# Altium schematic sheet ethernet.SchDoc: Edison Gateway - Ethernet
size Letter; Author: Ye-Sheng Kuo; DocumentNumber: 6; Revision: 3; SheetNumber: 6; SheetTotal: 10
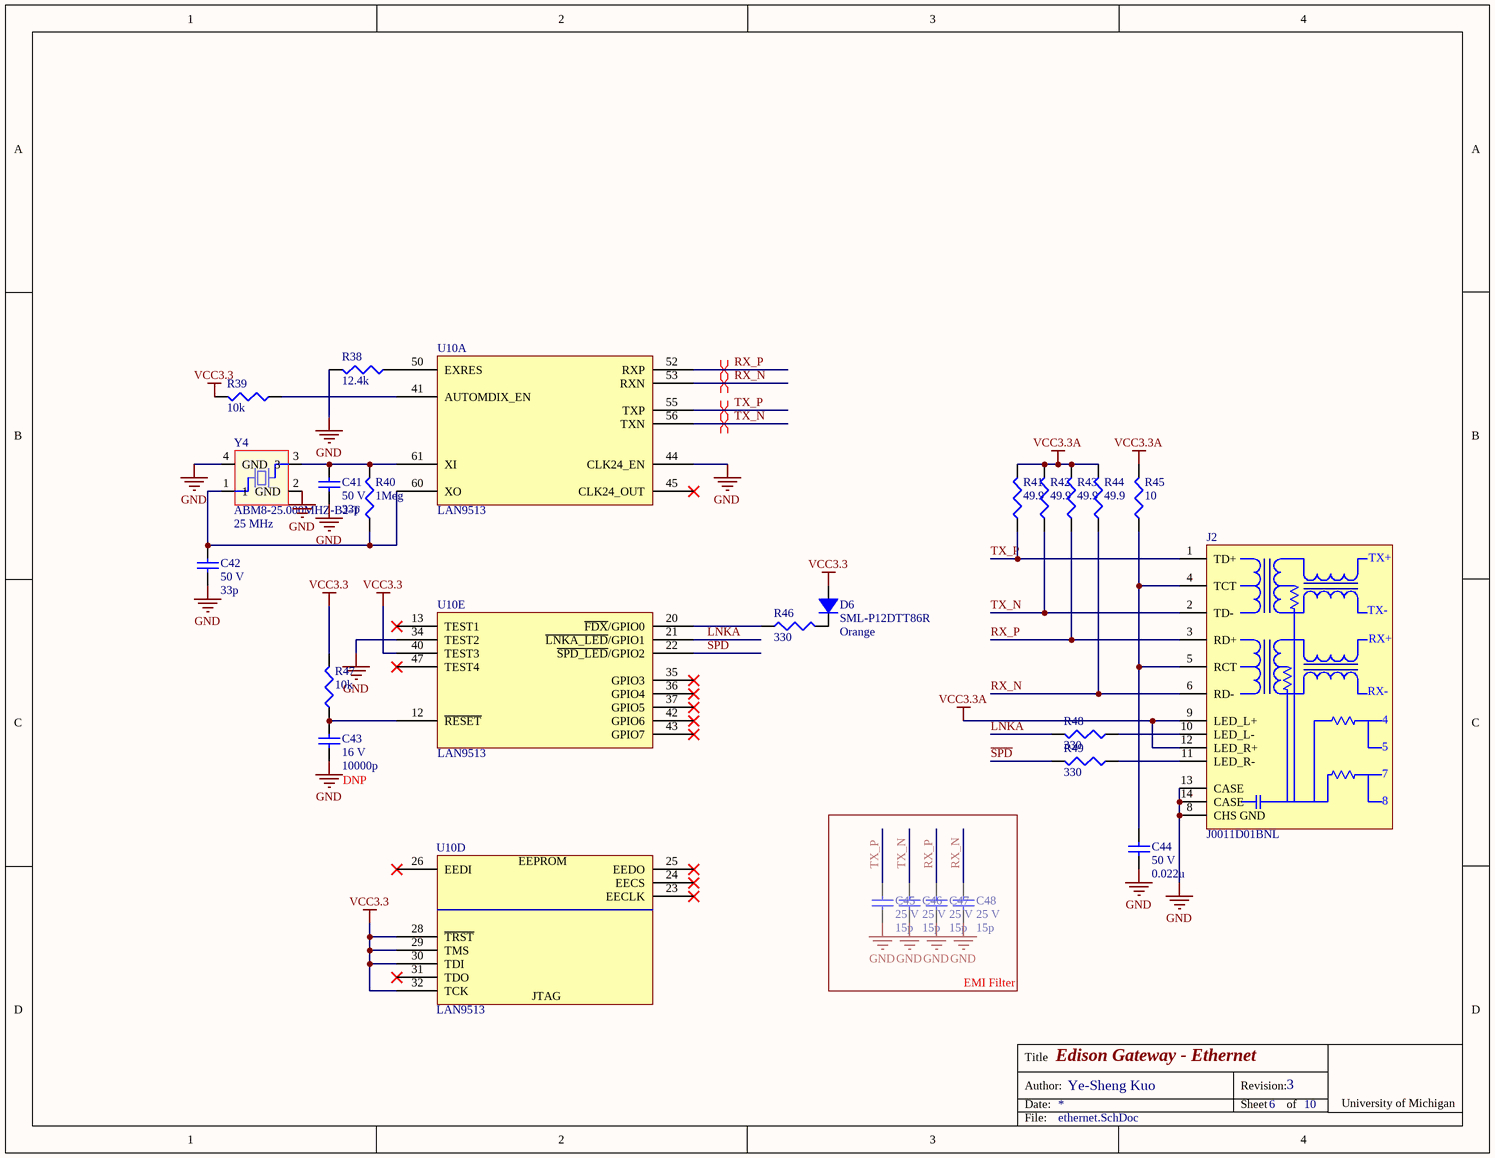
[diagram p0: ethernet.SchDoc]

## Parts
C41  voltage rated: 50 V  [0402]  (hidden comment: 33p)
C42  voltage rated: 50 V  [0402]  (hidden comment: 33p)
C43  voltage rated: 16 V  Note: DNP  [0402]  (hidden comment: 10000p)
C44  voltage rated: 50 V  [0402]  (hidden comment: 0.022u)
C45  voltage rated: 25 V  [0402]  (hidden comment: 15p)
C46  voltage rated: 25 V  [0402]  (hidden comment: 15p)
C47  voltage rated: 25 V  [0402]  (hidden comment: 15p)
C48  voltage rated: 25 V  [0402]  (hidden comment: 15p)
D6  SML-P12DTT86R  value Orange  [0402 - LED]
J2  J0011D01BNL  [J0011D01BNL]
R38  12.4k  [0402]
R39  10k  [0402]
R40  1Meg  [0402]
R41  49.9  [0402]
R42  49.9  [0402]
R43  49.9  [0402]
R44  49.9  [0402]
R45  10  [0402]
R46  330  [0402]
R47  10k  [0402]
R48  330  [0402]
R49  330  [0402]
U10  LAN9513  [QFN-64]  (parts A,D,E of 5)
Y4  ABM8-25.000MHZ-B2-T  Frequency: 25 MHz  [ABM8]

## Blocks framed on the sheet
EMI Filter: C45-C48

## Nets
GND: C41.2 C42.2 C43.2 C44.2 C45.2 C46.2 C47.2 C48.2 J2.8(CHS_GND) J2.13(CASE) J2.14(CASE) R38.1 U10.34(TEST2) U10.44(CLK24_EN) Y4.2(GND) Y4.4(GND)
VCC3.3: D6.1 R39.1 R47.1 U10.28(~{TRST}) U10.29(TMS) U10.30(TDI) U10.32(TCK) U10.40(TEST3)
VCC3.3A: J2.9(LED_L+) J2.12(LED_R+) R41.1 R42.1 R43.1 R44.1 R45.1
~{LNKA}: R48.1 U10.21(~{LNKA_LED}/GPIO1)
RX_N: C48.1 J2.6(RD-) R44.2 U10.53(RXN)
RX_P: C47.1 J2.3(RD+) R43.2 U10.52(RXP)
~{SPD}: R49.1 U10.22(~{SPD_LED}/GPIO2)
TX_N: C46.1 J2.2(TD-) R42.2 U10.56(TXN)
TX_P: C45.1 J2.1(TD+) R41.2 U10.55(TXP)
NetC41_1: C41.1 R40.1 U10.61(XI) Y4.3
NetC42_1: C42.1 R40.2 U10.60(XO) Y4.1
NetC43_1: C43.1 R47.2 U10.12(~{RESET})
NetC44_1: C44.1 J2.4(TCT) J2.5(RCT) R45.2
NetD6_2: D6.2 R46.1
NetJ2_10: J2.10(LED_L-) R48.2
NetJ2_11: J2.11(LED_R-) R49.2
NetR38_2: R38.2 U10.50(EXRES)
NetR39_2: R39.2 U10.41(AUTOMDIX_EN)
NetR46_2: R46.2 U10.20(~{FDX}/GPIO0)

Not connected (* = marked no-connect by the designer): U10 13(TEST1)* 23(EECLK)* 24(EECS)* 25(EEDO)* 26(EEDI)* 31(TDO)* 35(GPIO3)* 36(GPIO4)* 37(GPIO5)* 42(GPIO6)* 43(GPIO7)* 45(CLK24_OUT)* 47(TEST4)*

## Layout directives
differential pair: RX_N, RX_P, TX_N, TX_P

## Notes on the sheet
- Title
- Date:
- Author:
- Revision:
- Sheet
- of
- University of Michigan
- File:
- (in symbol J0011D01BNL) TX+; TX-; RX+; RX-; 7
- (in symbol LAN9513, part D) EEPROM; JTAG

## Library data of the parts
C41 C42 = GRM1555C1H330JA01D: 33pF ±5% 50V Ceramic Capacitor C0G, NP0 0402; Manufacture: Murata; tolerance: 5%; package: 0402; Supplier 1: Digi-Key; Supplier Part Number 1: 490-5936-1-ND; Value: 33p; Temperature Coefficient: C0G, NP0; Manufacturer Part Number: GRM1555C1H330JA01D
C43 = GRM155R71C103KA01D: 10000pF ±10% 16V Ceramic Capacitor X7R 0402; Manufacture: Murata; tolerance: 10%; package: 0402; Temperature Coefficient: X7R; Supplier 1: Digi-Key; Supplier Part Number 1: 490-1313-1-ND; Value: 10000p; Manufacturer Part Number: GRM155R71C103KA01D
C44 = GRM155R71H223KA12D: 0.022µF ±10% 50V Ceramic Capacitor X7R 0402; Manufacture: Murata; tolerance: 10%; package: 0402; Temperature Coefficient: X7R; Supplier 1: Digi-Key; Supplier Part Number 1: 490-3884-1-ND; Value: 0.022u; Manufacturer Part Number: GRM155R71H223KA12D
C45-C48 = GRM1555C1E150JA01D: 15pF ±5% 25V Ceramic Capacitor C0G, NP0 0402; Manufacture: Murata; tolerance: 5%; package: 0402; Supplier 1: Digi-Key; Supplier Part Number 1: 490-8171-1-ND; Value: 15p; Temperature Coefficient: C0G, NP0; Manufacturer Part Number: GRM1555C1E150JA01D
D6 = SML-P12DTT86R: Orange 605nm LED Indication - Discrete 2.1V 0402; Manufacturer: Rohm Semiconductor; Current @ VF: 20 mA; Supplier 1: Digi-Key; Supplier Part Number 1: 846-1200-1-ND; package: 0402; Forward Voltage: 2.1 V; Manufacturer Part Number: SML-P12DTT86R; Wavelength: 605 nm
J2 = J0011D01BNL: 1x1 Tab-Down RJ45; Supplier 1: Digi-Key; Supplier Part Number 1: 553-1483-ND
R38 = RC0402FR-0712K4L: RES SMD 12.4K OHM 1% 1/16W 0402; Manufacturer: Yageo; Temperature Coefficient: 100 ppm/C; Tolerance: 1%; Power: 1/16 W; package: 0402; Supplier 1: Digi-Key; Supplier Part Number 1: 311-12.4KLRCT-ND; value: 12.4k; Manufacturer Part Number: RC0402FR-0712K4L
R39 R47 = CRCW040210K0FKED: RES SMD 10K OHM 1% 1/16W 0402; Manufacturer: Vishay Dale; Temperature Coefficient: 100 ppm/C; Tolerance: 1%; Power: 1/16 W; package: 0402; Supplier 1: Digi-Key; Supplier Part Number 1: 541-10.0KLCT-ND; value: 10k; Manufacturer Part Number: CRCW040210K0FKED
R40 = CRCW04021M00FKED: RES SMD 1M OHM 1% 1/16W 0402; Manufacturer: Vishay Dale; Temperature Coefficient: 100 ppm/C; Tolerance: 1%; Power: 1/16 W; Supplier 1: Digi-Key; Supplier Part Number 1: 541-1.00MLCT-ND; package: 0402; value: 1Meg; Manufacturer Part Number: CRCW04021M00FKED
R41-R44 = CRCW040249R9FKED: RES SMD 49.9 OHM 1% 1/16W 0402; Manufacturer: Vishay Dale; Temperature Coefficient: 100 ppm/C; Tolerance: 1%; Power: 1/16 W; package: 0402; Supplier 1: Digi-Key; Supplier Part Number 1: 541-49.9LCT-ND; value: 49.9; Manufacturer Part Number: CRCW040249R9FKED
R45 = CRCW040210R0FKED: RES SMD 10 OHM 1% 1/16W 0402; Manufacturer: Vishay Dale; Temperature Coefficient: 100 ppm/C; Tolerance: 1%; Power: 1/16 W; package: 0402; Supplier 1: Digi-Key; Supplier Part Number 1: 541-10.0LCT-ND; value: 10; Manufacturer Part Number: CRCW040210R0FKED
R46 R48 R49 = CRCW0402330RFKED: RES SMD 330 OHM 1% 1/16W 0402; Manufacturer: Vishay Dale; Temperature Coefficient: 100 ppm/C; Tolerance: 1%; Power: 1/16 W; package: 0402; Supplier 1: Digi-Key; Supplier Part Number 1: 541-330LCT-ND; value: 330; Manufacturer Part Number: CRCW0402330RFKED
U10 = LAN9513: USB 2.0 Hub and 10/100  Ethernet Controller; Supplier 1: Digi-Key; Supplier Part Number 1: LAN9513-JZX-ND
Y4 = ABM8-25.000MHZ-B2-T: Crystal 25.0000MHz 20ppm 18pF 50 Ohm; Frequency stability: 50 ppm; ESR: 50 ohm; Load capacitance: 18 pF; Frequency tolerance: 20 ppm; Supplier 1: Digi-Key; Supplier Part Number 1: 535-9140-1-ND